# Altium schematic sheet CoffeeScale_charger.SchDoc
size A4
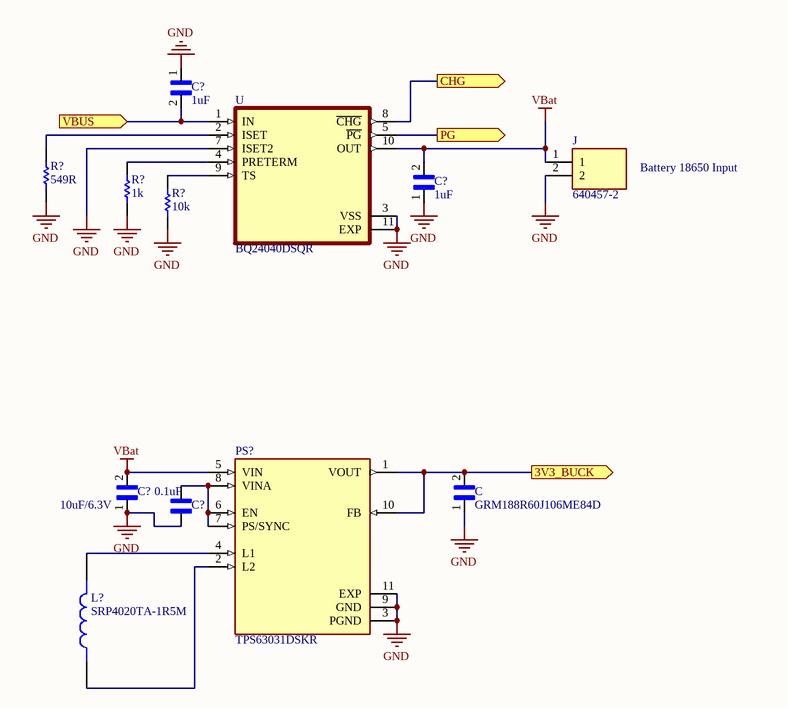
[diagram p0: CoffeeScale_charger.SchDoc]

## Parts
(Parts that share a designator on the sheet are numbered #1, #2 ... from top to bottom, then left to right.)
C  GRM188R60J106ME84D  [CAPC1608X90N]
C?#1  1uF  [CAPC1005X55N]
C?#2  1uF  [CAPC1005X55N]
C?#3  10uF/6.3V  [CAPC1608X90N]
C?#4  0.1uF  [CAPC1005X55N]
J  640457-2  [TE_640457-2]
L?  SRP4020TA-1R5M  [IND_SRP4020TA-1R5M]
PS?  TPS63031DSKR  [SON50P250X250X80-11N]
R?#1  549R  [RESC1005X40N]
R?#2  1k  [RESC1005X40N]
R?#3  10k  [RESC1005X40N]
U  BQ24040DSQR  [SON40P200X200X80-11N]

## Ports
3V3_BUCK (out), CHG (out), PG (out), VBUS (in)

## Nets
GND: C.1 C?#1.1 C?#2.1 C?#3.1 C?#4.1 J.2 PS?.3(PGND) PS?.9(GND) PS?.11(EXP) R?#1.1 R?#2.1 R?#3.1 U.3(VSS) U.7(ISET2) U.11(EXP)
VBat: C?#2.2 C?#3.2 J.1 PS?.5(VIN) U.10(OUT)
3V3_BUCK: C.2 PS?.1(VOUT) PS?.10(FB) ; port 3V3_BUCK
CHG: U.8(~{CHG}) ; port CHG
PG: U.5(~{PG}) ; port PG
VBUS: C?#1.2 U.1(IN) ; port VBUS
NetC?#4_2: C?#4.2 PS?.6(EN) PS?.7(PS/SYNC) PS?.8(VINA)
NetL?_1: L?.1 PS?.2(L2)
NetL?_2: L?.2 PS?.4(L1)
NetR?#1_2: R?#1.2 U.2(ISET)
NetR?#2_2: R?#2.2 U.4(PRETERM)
NetR?#3_2: R?#3.2 U.9(TS)

## Notes on the sheet
- Battery 18650 Input
- Title:
- Size:
- Author:
- A4
- Sheet
- of
- Revision:
- File:
- Date:

## Library data of the parts
C C?#3 = GRM188R60J106ME84D: SMD Capacitor X5R(EIA) with Capacitance: 10uF Tol. 20%. Rated Voltage: 6.3Vdc; MF: Murata; Value: *; Availability: Unavailable; Price: None; SnapEDA_Link: https://www.snapeda.com/parts/GRM188R60J106ME84D/Murata%20Electronics%20North%20America/view-part/423309/?ref=snap; MP: GRM188R60J106ME84D; DigiKey-Purchase-URL: https://snapeda.com/shop?store=DigiKey&id=423309; Package: 1608 Murata
C?#1 C?#2 = CL05A105KO5NNNC: 1ÂµF Â±10% 16V Ceramic Capacitor X5R 0402 (1005 Metric); MF: Samsung Electro-Mechanics; Purchase-URL: https://pricing.snapeda.com/search/part/CL05A105KO5NNNC/?ref=eda; SnapEDA_Link: https://www.snapeda.com/parts/CL05A105KO5NNNC/Samsung%20Electro-Mechanics/view-part/3598151/?ref=snap; Availability: Good; Price: None; MP: CL05A105KO5NNNC; Check_prices: https://www.snapeda.com/parts/CL05A105KO5NNNC/Samsung%20Electro-Mechanics/view-part/3598151/?ref=eda; Package: 0402 Samsung; Value: *
C?#4 = GRM155R71H104KE14D: SMD capacitor X7R(EIA) with capacitance 0.10uF Tol.10%. Rated voltage 50Vdc 125C; MF: Murata Electronics; SnapEDA_Link: https://www.snapeda.com/parts/GRM155R71H104KE14D/Murata+Electronics+North+America/view-part/?ref=snap; Package: 1005 Taiyo Yuden; Value: *; MP: GRM155R71H104KE14D; Check_prices: https://www.snapeda.com/parts/GRM155R71H104KE14D/Murata+Electronics+North+America/view-part/?ref=eda
J = 640457-2: Header, Friction Lock; MTA-100; 2; 250 VAC; Polyester; Tin; Copper Alloy; Tin; Product_Type: Connector; Number_of_Positions: 2; MF: TE Connectivity; Centerline_Pitch: 2.54 mm[.1 in]; Package: None; Digi-Key_Purchase_URL: https://www.digikey.com/product-detail/en/te-connectivity-amp-connectors/640457-2/A1926-ND/109016?utm_source=snapeda&utm_medium=aggregator&utm_campaign=symbol; Digi-Key_Part_Number: A1926-ND; SnapEDA_Link: https://www.snapeda.com/parts/640457-2/TE%20Connectivity%20AMP%20Connectors/view-part/532921/?ref=snap; EU_RoHS_Compliance: Compliant; MP: 640457-2; TE_purchase_URL: https://www.te.com/usa-en/product-640457-2.html?te_bu=Cor&te_type=disp&te_campaign=seda_glo_cor-seda-global-disp-prtnr-fy19-seda-model-bom-cta_sma-317_1&elqCampaignId=32493; Value: *
L? = SRP4020TA-1R5M: 1.5 ÂµH Shielded Drum Core, Wirewound Inductor 4.5 A 42mOhm Max 2-SMD; MF: Bourns; Check_prices: https://www.snapeda.com/parts/SRP4020TA-1R5M/Bourns/view-part/?ref=eda; Package: SMD-2 Bourns; MP: SRP4020TA-1R5M; Value: *; Purchase-URL: https://pricing.snapeda.com/search/part/SRP4020TA-1R5M/?ref=eda; SnapEDA_Link: https://www.snapeda.com/parts/SRP4020TA-1R5M/Bourns/view-part/?ref=snap; Availability: In Stock; Price: None
PS? = TPS63031DSKR: High Efficient Single Inductor Buck-Boost Converter with 1-A Switches; MP: TPS63031DSKR; Availability: Unavailable; Value: *; Package: None; Price: None
R?#1 = RC0402FR-07549RL: RC0402 549R 1% 0,063W; Package: None; Price: None; Value: *; MP: RC0402FR-07549RL; Availability: Unavailable
R?#2 = RC0402FR-071KL: 1 kOhms Â±1% 0.063W, 1/16W Chip Resistor 0402 (1005 Metric) Moisture Resistant Thick Film; MF: Yageo; SnapEDA_Link: https://www.snapeda.com/parts/RC0402FR-071KL/Yageo/view-part/?ref=snap; Package: 1005 Panasonic Electronic Components; Value: *; MP: RC0402FR-071KL; Check_prices: https://www.snapeda.com/parts/RC0402FR-071KL/Yageo/view-part/?ref=eda
R?#3 = CR0402-FX-1002GLF: Res Thick Film 0402 10K Ohm 1% 1/16W Â±100ppm/Â°C Molded SMD SMD Paper Tape on Plastic Reel; Package: None; Price: None; Value: *; MP: CR0402-FX-1002GLF; Availability: Unavailable
U = BQ24040DSQR: Standalone 1-cell 1-A linear battery charger with 4.2-V VBAT and Temperature Sensing 10-WSON 0 to 125; MF: Texas Instruments; SnapEDA_Link: https://www.snapeda.com/parts/BQ24040DSQR/Texas%20Instruments/view-part/229310/?ref=snap; Mouser-Purchase-URL: https://snapeda.com/shop?store=Mouser&id=229310; Digi-Key_Part_Number: 296-37142-1-ND; DigiKey-Purchase-URL: https://snapeda.com/shop?store=DigiKey&id=229310; Value: *; Texas_Instruments-Purchase-URL: https://snapeda.com/shop?store=Texas+Instruments&id=229310; MP: BQ24040DSQR; Package: WSON-10 Texas Instruments